# Altium schematic sheet LM2576_V1.0.schdoc
size A4
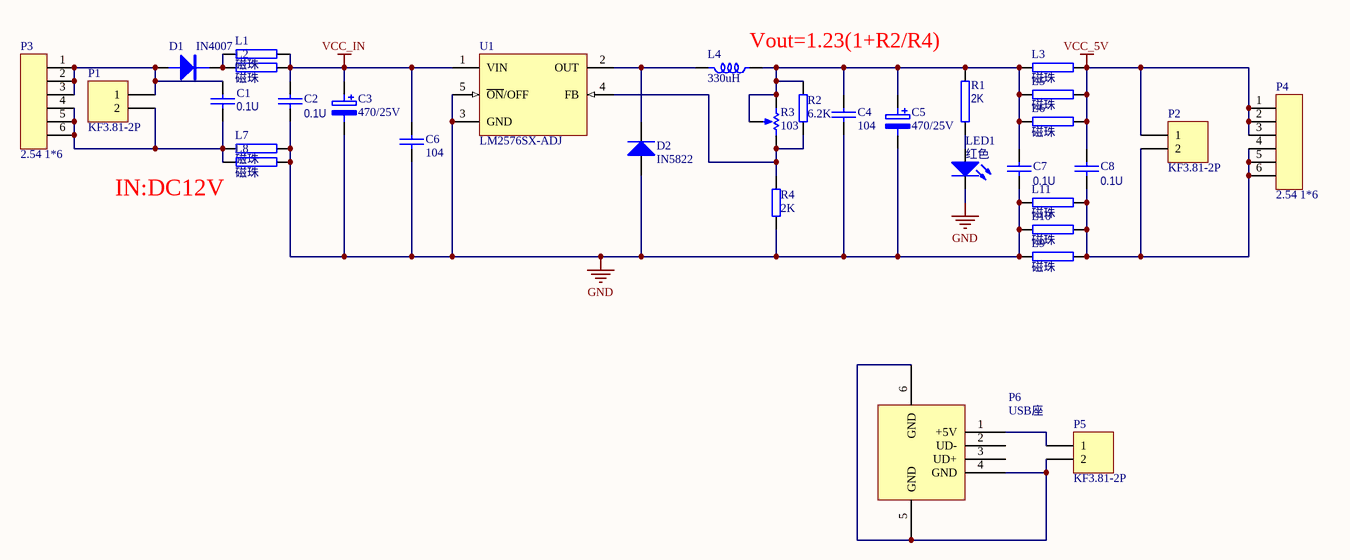
[diagram p0: LM2576_V1.0.schdoc]

## Parts
C1  0.1U  [0805]
C2  0.1U  [0805]
C3  470/25V  [电容 铝电解 470U/35V]
C4  104  [0805]
C5  470/25V  [电容 铝电解 470U/35V]
C6  104  [0805]
C7  0.1U  [0805]
C8  0.1U  [0805]
D1  IN4007  [二极管 贴片 4007]
D2  IN5822  [二极管 贴片 4007]
L1  磁珠  [0805]
L2  磁珠  [0805]
L3  磁珠  [0805]
L4  330uH  [电感 贴片 12*12]
L5  磁珠  [0805]
L6  磁珠  [0805]
L7  磁珠  [0805]
L8  磁珠  [0805]
L9  磁珠  [0805]
L10  磁珠  [0805]
L11  磁珠  [0805]
LED1  红色  [LED0805]
P1  KF3.81-2P  [KF127S-3.81-2P]
P2  KF3.81-2P  [KF127S-3.81-2P]
P3  2.54 1*6  [单排插针 2.54 1*6]
P4  2.54 1*6  [单排插针 2.54 1*6]
P5  KF3.81-2P  [KF127S-3.81-2P]
P6  USB座  [USB座 母头1 侧卧]
R1  2K  [0805]
R2  6.2K  [0805]
R3  103  [电位器]
R4  2K  [0805]
U1  LM2576SX-ADJ  [TO263 LM2576]

## Nets
GND: C2.1 C3.2 C4.1 C5.2 C6.1 C7.1 D2.1(A) L7.1 L8.1 L9.1 L10.1 L11.1 LED1.2(K) R4.2 U1.3(GND) U1.5(~{ON}/OFF)
VCC_5V: C8.2 L3.2 L5.2 L6.2 P2.1 P4.1 P4.2 P4.3
VCC_IN: C2.2 C3.1 C6.2 L1.1 L2.1 U1.1(VIN)
NetC1_1: C1.1 L7.2 L8.2 P1.2 P3.4 P3.5 P3.6
NetC1_2: C1.2 D1.1 P1.1 P3.1 P3.2 P3.3
NetC4_2: C4.2 C5.1 C7.2 L3.1 L4.2 L5.1 L6.1 R1.2 R2.1 R3.1(TOP) R3.2(TAP)
NetC8_1: C8.1 L9.2 L10.2 L11.2 P2.2 P4.4 P4.5 P4.6
NetD1_2: D1.2 L1.2 L2.2
NetD2_2: D2.2(K) L4.1 U1.2(OUT)
NetLED1_1: LED1.1(A) R1.1
NetP5_1: P5.1 P6.1(+5V)
NetP5_2: P5.2 P6.4(GND) P6.5(GND) P6.6(GND)
NetR2_2: R2.2 R3.3(BOT) R4.1 U1.4(FB)

Not connected (* = marked no-connect by the designer): P6 2(UD-) 3(UD+)

## Notes on the sheet
- (near L4) Vout=1.23(1+R2/R4)
- IN:DC12V

## Library data of the parts
C1 C2 C7 C8 = CAP
C3 C5 = 电容 贴片 铝电解 470u/25V: 名称: 贴片铝电解电容; 封装: 贴片; 单位: 个
C4 C6 = 电容 贴片 0805: 名称: 贴片电容; 单位: 个; 封装: 0805
D1 = DIODE
D2 = 二极管 贴片4007: 名称: 贴片二极管; 封装: 贴片; 单位: 个
L1-L3 L5-L11 R1 = RES2
L4 = 电感 贴片 0805: 名称: 贴片电感; 封装: 0805; 单位: 个
LED1 = 二极管 贴片发光 0805: 名称: 贴片发光二极管; 封装: 0805; 单位: 个
P1 P2 P5 = 联结件 XH2.54-2: 名称: 联结件; 封装: VH3.96-2; 单位: 套
P3 P4 = 连接件 单排插针 2.54 1*6: 单位: 片; 封装: DIP; 名称: 单排插针
P6 = 连接件 USB座: 单位: 个; 封装: 440068; 名称: 联结件
R2 R4 = 电阻 贴片 0805: 名称: 贴片电阻; 单位: 个; 封装: 0805
R3 = 电位器 3296: 封装: 3296; 单位: 个; 名称: 电位器
U1 = LM2576SX-5.0: DC-DC芯片; ComponentLink1Description: 供应商链接; ComponentLink1URL: http://www.szlcsc.com/product/details_35434.html; Package: TO-263-5; Supplier: LC; SuppliersPartNumber: C34465